# Altium schematic sheet Sheet1.SchDoc
size A; SheetNumber: 1; SheetTotal: 1
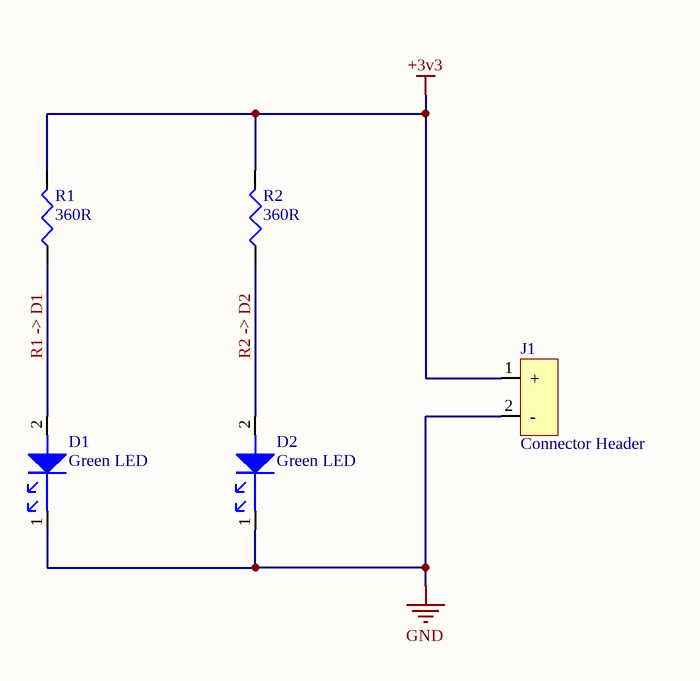
[diagram p0: Sheet1.SchDoc]

## Parts
D1  Green LED  [Led_0603]
D2  Green LED  [Led_0603]
J1  Connector Header  [Header_1x2]
R1  360R  [R0805]
R2  360R  [R0805]

## Nets
+3v3: J1.1(+) R1.2 R2.2
GND: D1.1 D2.1 J1.2(-)
R1 -> D1: D1.2 R1.1
R2 -> D2: D2.2 R2.1

## Library data of the parts
D1 D2 = Diode LED: Green 572nm LED Indication - Discrete 2V 0603 (1608 Metric); Manufacturer: VCC; Manufacturer Part Number: LSM0603453V; Forward Current: 20mA; Forward Voltage: 3.4V; Luminous Intensity: 120mcd; Number of Circuits: 1; Power Dissipation: 60mW; Reverse Voltage: 5V; Shape: Rectangular; Viewing Angle: 110°; Wavelength: 576nm; Supplier: DigiKey; Supplier Part Number: LSM0603453VCT-ND; RoHS: Compliant; Category: LEDs; Stock: 28165; Pricing: 1=0.39, 10=0.266, 100=0.1218, 500=0.1086, 1000=0.1071 (USD); Case/Package: 0603; Color: Green; Height: 600µm; Lifecycle Status: Production; Max Operating Temperature: 85°C; Min Operating Temperature: -40°C; Mounting Technology: Surface Mount; Number of Terminals: 2; REACH SVHC: Yes; Schedule B: 8541402000, 8541406050, 8541406050|8541406050|8541406050|8541406050|8541406050; Terminal Pitch: 1.3mm; ComponentLink1URL: https://datasheet.octopart.com:443/LSM0603453V-Visual-Communications-datasheet-166617523.pdf?src-supplier=RS+(Formerly+Allied+Electronics); ComponentLink1Description: https://datasheet.octopart.com:443/LSM0603453V-Visual-Communications-datasheet-166617523.pdf?src-supplier=RS+(Formerly+Allied+Electronics); ComponentLink2URL: https://datasheet.octopart.com:443/LSM0603453V-Visual-Communications-datasheet-120107411.pdf?src-supplier=VCC; ComponentLink2Description: https://datasheet.octopart.com:443/LSM0603453V-Visual-Communications-datasheet-120107411.pdf?src-supplier=VCC
J1 = Connector Header: KK 254 Wire-to-Board Header, Vertical, with Friction Lock, 2 Circuits, Tin (Sn) Plating; Manufacturer: Molex; Manufacturer Lifecycle Status: ACTIVE; Approvals: CSA, UL; Contact Resistance: 10mΩ; Current Rating: 4A; Dielectric Material: Polyamide; Gender: Male; Insulation Resistance: 1GΩ; Number of Circuits: 2; Pitch: 2.54mm; Plating Thickness: 2.54µm; Voltage Rating: 500V; Voltage Rating (AC): 250V; Supplier: DigiKey; Supplier Part Number: WM4111-ND; Manufacturer Part Number: 22-27-2021; RoHS: Compliant; Category: Headers and Wire Housings; Stock: 100550; Pricing: 1=0.24, 10=0.208, 100=0.1765, 500=0.15752, 2850=0.13929, 5700=0.13264, 11400=0.12631 (USD); China RoHS: Compliant; Color: White; Contact Gender: Male; Contact Material: Brass; Contact Plating: Tin; Country of Origin: TH; Depth: 5.8mm; Flammability Rating: UL94 V-0; Height: 12.05mm; Housing Color: Natural; Housing Material: Nylon; Lead Free: Lead Free; Lead Pitch: 2.54mm; Length: 10.16mm; Lifecycle Status: Production; Material: Nylon; Max Current Rating: 4A; Max Operating Temperature: 75°C; Min Operating Temperature: 0°C; Mounting Technology: Through Hole; Number of Contacts: 2; Pins: 2; Number of Positions: 2; Number of Rows: 1; Orientation: Vertical; Plating: Tin; Radiation Hardening: No; REACH SVHC: Yes; Schedule B: 8536694040, 8536694040|8536694040|8536694040|8536694040|8536694040|8536694040|8536694040|8536694040|8536694040|8536694040|8536694040|8536694040|8536694040|8536694040|8536694040|8536694040|8536694040|8536694040|8536694040|8536694040|8536694040|8536694040|8536694040|85; Terminal Pitch: 2.54mm; Termination: Solder; Voltage Rating (DC): 250V; Working Voltage: 250V; ComponentLink1URL: https://datasheet.octopart.com:443/22-27-2021-Molex-datasheet-81843831.pdf?src-supplier=Upverter; ComponentLink1Description: https://datasheet.octopart.com:443/22-27-2021-Molex-datasheet-81843831.pdf?src-supplier=Upverter; ComponentLink2URL: https://datasheet.octopart.com:443/22-27-2021-Molex-datasheet-10979409.pdf?src-supplier=Molex; ComponentLink2Description: https://datasheet.octopart.com:443/22-27-2021-Molex-datasheet-10979409.pdf?src-supplier=Molex; ComponentLink3URL: https://datasheet.octopart.com:443/02227-2021-Molex-datasheet-13784872.pdf?src-supplier=Molex; ComponentLink3Description: https://datasheet.octopart.com:443/02227-2021-Molex-datasheet-13784872.pdf?src-supplier=Molex; ComponentLink4URL: https://datasheet.octopart.com:443/22-27-2021-Molex-datasheet-5315839.pdf?src-supplier=Future+Electronics; ComponentLink4Description: https://datasheet.octopart.com:443/22-27-2021-Molex-datasheet-5315839.pdf?src-supplier=Future+Electronics; ComponentLink5URL: https://datasheet.octopart.com:443/22272021-Molex-datasheet-137316104.pdf?src-supplier=Future+Electronics; ComponentLink5Description: https://datasheet.octopart.com:443/22272021-Molex-datasheet-137316104.pdf?src-supplier=Future+Electronics; ComponentLink6URL: https://datasheet.octopart.com:443/22-27-2021-Molex-datasheet-154747145.pdf?src-supplier=Master+Electronics; ComponentLink6Description: https://datasheet.octopart.com:443/22-27-2021-Molex-datasheet-154747145.pdf?src-supplier=Master+Electronics; ComponentLink7URL: https://datasheet.octopart.com:443/22-27-2021-Molex-datasheet-101581847.pdf?src-supplier=Farnell; ComponentLink7Description: https://datasheet.octopart.com:443/22-27-2021-Molex-datasheet-101581847.pdf?src-supplier=Farnell; ComponentLink8URL: https://datasheet.octopart.com:443/02227-2021-Molex-datasheet-14711101.pdf?src-supplier=Farnell; ComponentLink8Description: https://datasheet.octopart.com:443/02227-2021-Molex-datasheet-14711101.pdf?src-supplier=Farnell; ComponentLink9URL: https://datasheet.octopart.com:443/22-27-2021-Molex-datasheet-506551.pdf?src-supplier=Farnell; ComponentLink9Description: https://datasheet.octopart.com:443/22-27-2021-Molex-datasheet-506551.pdf?src-supplier=Farnell; ComponentLink10URL: https://datasheet.octopart.com:443/22-27-2021-Molex-datasheet-21538535.pdf?src-supplier=Newark; ComponentLink10Description: https://datasheet.octopart.com:443/22-27-2021-Molex-datasheet-21538535.pdf?src-supplier=Newark; ComponentLink11URL: https://datasheet.octopart.com:443/22-27-2021-Molex-datasheet-38329585.pdf?src-supplier=Newark; ComponentLink11Description: https://datasheet.octopart.com:443/22-27-2021-Molex-datasheet-38329585.pdf?src-supplier=Newark; ComponentLink12URL: https://datasheet.octopart.com:443/22-27-2021-Molex-datasheet-33021744.pdf?src-supplier=Newark; ComponentLink12Description: https://datasheet.octopart.com:443/22-27-2021-Molex-datasheet-33021744.pdf?src-supplier=Newark; ComponentLink13URL: https://datasheet.octopart.com:443/22-27-2021-Molex-datasheet-33002331.pdf?src-supplier=Newark; ComponentLink13Description: https://datasheet.octopart.com:443/22-27-2021-Molex-datasheet-33002331.pdf?src-supplier=Newark; ComponentLink14URL: https://datasheet.octopart.com:443/02227-2021-Molex-datasheet-21206939.pdf?src-supplier=Newark; ComponentLink14Description: https://datasheet.octopart.com:443/02227-2021-Molex-datasheet-21206939.pdf?src-supplier=Newark; ComponentLink15URL: https://datasheet.octopart.com:443/22-27-2021-Molex-datasheet-604178.pdf?src-supplier=element14+APAC; ComponentLink15Description: https://datasheet.octopart.com:443/22-27-2021-Molex-datasheet-604178.pdf?src-supplier=element14+APAC; ComponentLink16URL: https://datasheet.octopart.com:443/0022272021-Molex-datasheet-164461543.pdf?src-supplier=Sager+Electronics; ComponentLink16Description: https://datasheet.octopart.com:443/0022272021-Molex-datasheet-164461543.pdf?src-supplier=Sager+Electronics; ComponentLink17URL: https://datasheet.octopart.com:443/22-27-2021-Molex-datasheet-158567618.pdf?src-supplier=RS+(Formerly+Allied+Electronics); ComponentLink17Description: https://datasheet.octopart.com:443/22-27-2021-Molex-datasheet-158567618.pdf?src-supplier=RS+(Formerly+Allied+Electronics); ComponentLink18URL: https://datasheet.octopart.com:443/22-27-2021-Molex-datasheet-140181058.pdf?src-supplier=RS+(Formerly+Allied+Electronics); ComponentLink18Description: https://datasheet.octopart.com:443/22-27-2021-Molex-datasheet-140181058.pdf?src-supplier=RS+(Formerly+Allied+Electronics); ComponentLink19URL: https://datasheet.octopart.com:443/22-27-2021-Molex-datasheet-120145351.pdf?src-supplier=RS+(Formerly+Allied+Electronics); ComponentLink19Description: https://datasheet.octopart.com:443/22-27-2021-Molex-datasheet-120145351.pdf?src-supplier=RS+(Formerly+Allied+Electronics); ComponentLink20URL: https://datasheet.octopart.com:443/22-27-2021-Molex-datasheet-9995492.pdf?src-supplier=RS+(Formerly+Allied+Electronics); ComponentLink20Description: https://datasheet.octopart.com:443/22-27-2021-Molex-datasheet-9995492.pdf?src-supplier=RS+(Formerly+Allied+Electronics); ComponentLink21URL: https://datasheet.octopart.com:443/22-27-2021-Molex-datasheet-155977274.pdf?src-supplier=SOS+electronic; ComponentLink21Description: https://datasheet.octopart.com:443/22-27-2021-Molex-datasheet-155977274.pdf?src-supplier=SOS+electronic; ComponentLink22URL: https://datasheet.octopart.com:443/22-27-2021-Molex-datasheet-62103479.pdf?src-supplier=Electro+Sonic; ComponentLink22Description: https://datasheet.octopart.com:443/22-27-2021-Molex-datasheet-62103479.pdf?src-supplier=Electro+Sonic; ComponentLink23URL: https://datasheet.octopart.com:443/22-27-2021-Molex-datasheet-37168867.pdf?src-supplier=Electro+Sonic; ComponentLink23Description: https://datasheet.octopart.com:443/22-27-2021-Molex-datasheet-37168867.pdf?src-supplier=Electro+Sonic; ComponentLink24URL: https://datasheet.octopart.com:443/22-27-2021-Molex-datasheet-151821780.pdf?src-supplier=Toby+Electronics; ComponentLink24Description: https://datasheet.octopart.com:443/22-27-2021-Molex-datasheet-151821780.pdf?src-supplier=Toby+Electronics; ComponentLink25URL: https://datasheet.octopart.com:443/22-27-2021-Molex-datasheet-124775.pdf?src-supplier=DigiKey; ComponentLink25Description: https://datasheet.octopart.com:443/22-27-2021-Molex-datasheet-124775.pdf?src-supplier=DigiKey; ComponentLink26URL: https://datasheet.octopart.com:443/22-27-2021-Molex-datasheet-7627818.pdf?src-supplier=Jameco; ComponentLink26Description: https://datasheet.octopart.com:443/22-27-2021-Molex-datasheet-7627818.pdf?src-supplier=Jameco; ComponentLink27URL: https://datasheet.octopart.com:443/22-27-2021-Molex-datasheet-17586671.pdf?src-supplier=TME; ComponentLink27Description: https://datasheet.octopart.com:443/22-27-2021-Molex-datasheet-17586671.pdf?src-supplier=TME; ComponentLink28URL: http://sigma.octopart.com:80/16297726/rohs_statement/Molex-02227-2021.pdf?src-supplier=Compliance+Statements; ComponentLink28Description: http://sigma.octopart.com:80/16297726/rohs_statement/Molex-02227-2021.pdf?src-supplier=Compliance+Statements; ComponentLink29URL: http://sigma.octopart.com:80/conflict_mineral_statement/Molex-company-72.pdf?src-supplier=Compliance+Statements; ComponentLink29Description: http://sigma.octopart.com:80/conflict_mineral_statement/Molex-company-72.pdf?src-supplier=Compliance+Statements; ComponentLink30URL: http://sigma.octopart.com:80/rohs_statement/Molex-company-73.pdf?src-supplier=Compliance+Statements; ComponentLink30Description: http://sigma.octopart.com:80/rohs_statement/Molex-company-73.pdf?src-supplier=Compliance+Statements; ComponentLink31URL: http://sigma.octopart.com:80/reach_statement/Molex-company-74.pdf?src-supplier=Compliance+Statements; ComponentLink31Description: http://sigma.octopart.com:80/reach_statement/Molex-company-74.pdf?src-supplier=Compliance+Statements
R1 R2 = Resistor: 360 Ohms ±1% 0.125W, 1/8W Chip Resistor 0805 (2012 Metric) Automotive AEC-Q200, Moisture Resistant Thick Film; Manufacturer: Yageo Group; Manufacturer Part Number: AC0805FR-07360RL; Max Power Dissipation: 125mW; Value: 360Ω; Temperature Coefficient: 100ppm/°C; Voltage Rating: 150V; Supplier: DigiKey; Supplier Part Number: 13-AC0805FR-07360RLCT-ND; RoHS: Compliant; Category: Chip SMD Resistors; Stock: 5172; Pricing: 1=0.1, 10=0.035, 25=0.0264, 50=0.0214, 100=0.0177, 250=0.014, 500=0.01188, 1000=0.01021 (USD); Case/Package: 0805; China RoHS: Non-Compliant; Composition: Thick Film; Depth: 1.25mm; Features: Automotive AEC-Q200, Moisture Resistant; Height: 500µm; Length: 2.0066mm; Lifecycle Status: Production; Max Operating Temperature: 155°C; Military Standard: Not; Min Operating Temperature: -55°C; Mounting Technology: Surface Mount; Number of Terminals: 2; Number of Terminations: 2; Power Dissipation: 125mW; REACH SVHC: Yes; Tolerance: 1%; Width: 1.25mm; Working Voltage: 150V; ComponentLink1URL: https://datasheet.octopart.com:443/AC0805FR-07360RL-Yageo-datasheet-182189377.pdf?src-supplier=IHS; ComponentLink1Description: https://datasheet.octopart.com:443/AC0805FR-07360RL-Yageo-datasheet-182189377.pdf?src-supplier=IHS; ComponentLink2URL: https://datasheet.octopart.com:443/AC0805FR-07360RL-Yageo-datasheet-83209224.pdf?src-supplier=Upverter; ComponentLink2Description: https://datasheet.octopart.com:443/AC0805FR-07360RL-Yageo-datasheet-83209224.pdf?src-supplier=Upverter; ComponentLink3URL: https://datasheet.octopart.com:443/AC0805FR-07360RL-Yageo-datasheet-178509465.pdf?src-supplier=Farnell; ComponentLink3Description: https://datasheet.octopart.com:443/AC0805FR-07360RL-Yageo-datasheet-178509465.pdf?src-supplier=Farnell; ComponentLink4URL: https://datasheet.octopart.com/AC0805FR-07360RL-Yageo-datasheet-12512238.pdf; ComponentLink4Description: https://datasheet.octopart.com/AC0805FR-07360RL-Yageo-datasheet-12512238.pdf; ComponentLink5URL: http://sigma.octopart.com:80/conflict_mineral_statement/Yageo-company-3.pdf?src-supplier=Compliance+Statements; ComponentLink5Description: http://sigma.octopart.com:80/conflict_mineral_statement/Yageo-company-3.pdf?src-supplier=Compliance+Statements; ComponentLink6URL: http://sigma.octopart.com:80/rohs_statement/Yageo-company-2.pdf?src-supplier=Compliance+Statements; ComponentLink6Description: http://sigma.octopart.com:80/rohs_statement/Yageo-company-2.pdf?src-supplier=Compliance+Statements